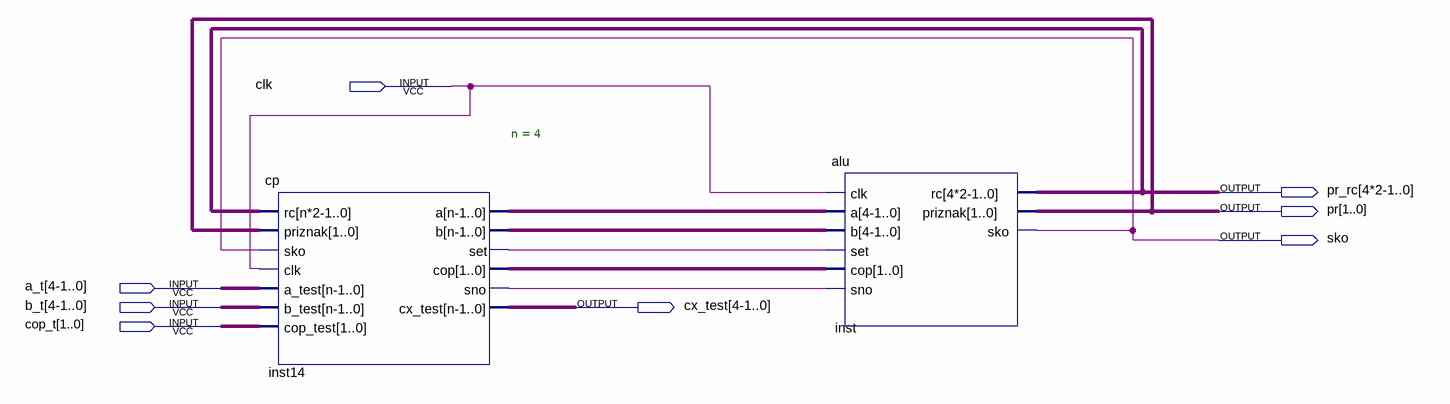
[diagram p0: schematic sheet]
// Quartus schematic cpu.bdf as structural Verilog: 2 symbols, 8 pins
module cpu (
  input  clk,
  input  \a_t[4-1..0] ,
  input  \b_t[4-1..0] ,
  input  [1:0] cop_t,
  output \pr_rc[4*2-1..0] ,
  output [1:0] pr,
  output sko,
  output \cx_test[4-1..0] 
);

  wire inst14_set, inst14_sno;
  wire [1:0] inst14_cop;
  wire [3:0] inst14_a, inst14_b, inst14_cx_test, undriven, undriven_2;
  wire [7:0] inst_rc_4_2_1__0_;

  cp #(.n(4)) inst14 (
    .rc(inst_rc_4_2_1__0_), .priznak(pr), .sko(sko), .clk(clk), .a_test(undriven_2), .b_test(undriven),
    .cop_test(cop_t), .a(inst14_a), .b(inst14_b), .set(inst14_set), .cop(inst14_cop), .sno(inst14_sno),
    .cx_test(inst14_cx_test));
  alu inst (
    .clk(clk), .\a[4-1..0] (inst14_a), .\b[4-1..0] (inst14_b), .set(inst14_set), .cop(inst14_cop),
    .sno(inst14_sno), .\rc[4*2-1..0] (inst_rc_4_2_1__0_), .priznak(pr), .sko(sko));
endmodule
